# Altium schematic sheet Comm.SchDoc
size A3
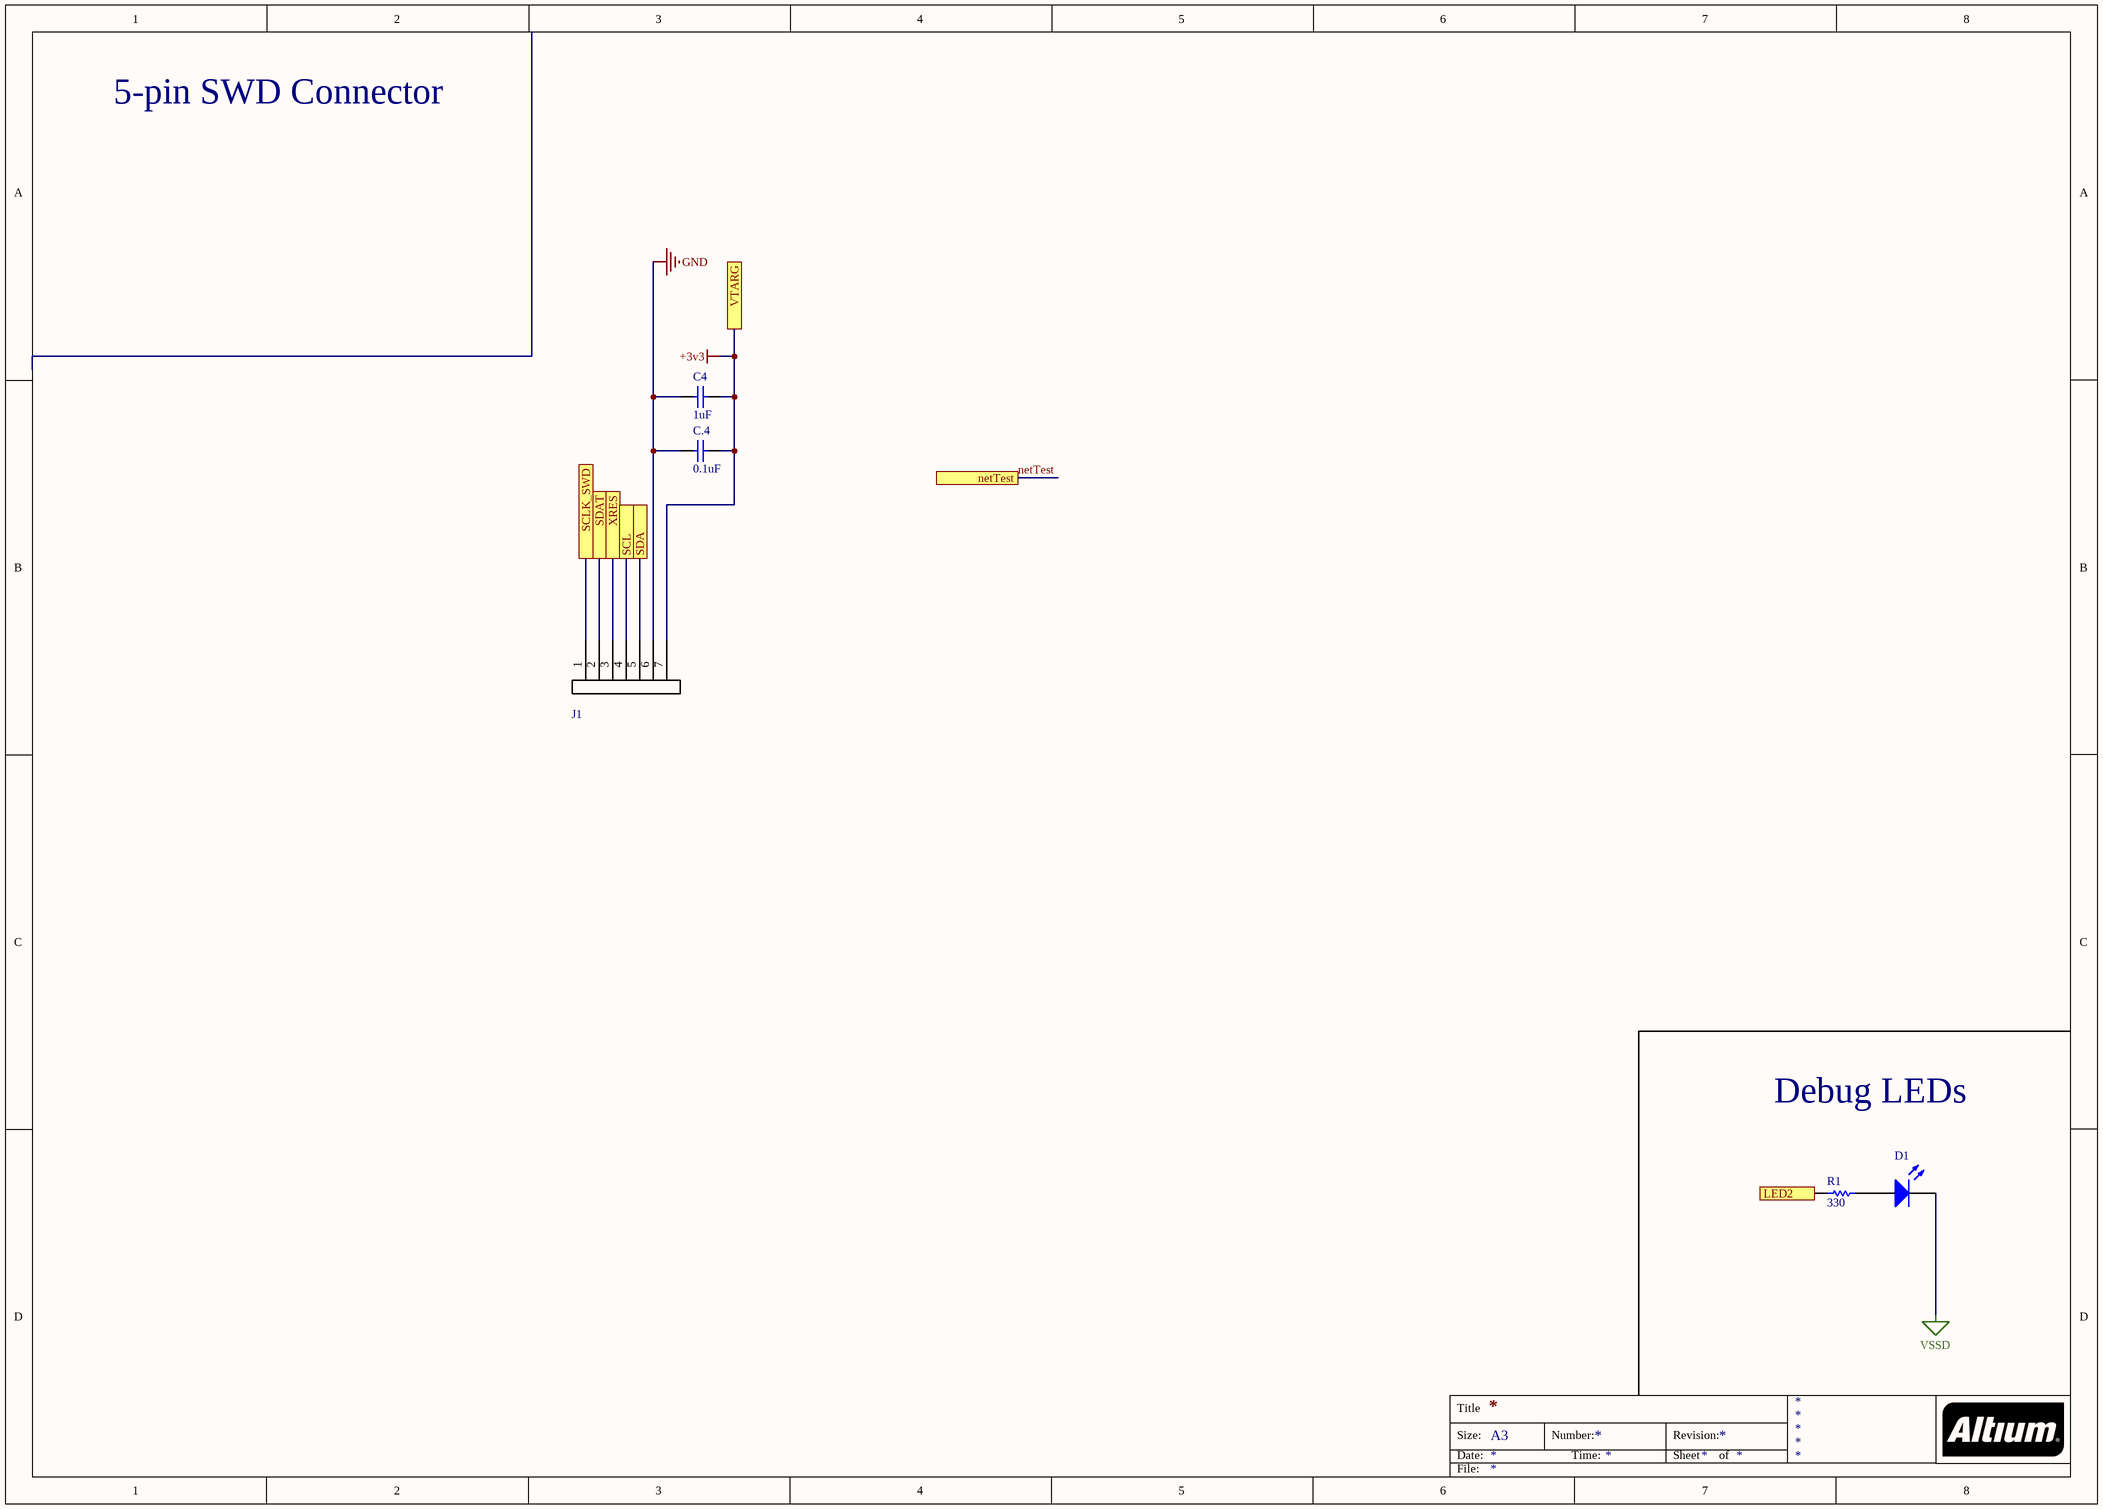
[diagram p0: Comm.SchDoc]

## Parts
C4  1uF  [CAPC0603(1608)100_N]
C.4  0.1uF  [CAPC0603(1608)100_N]
D1  150060BS75000  [0603_A]  (value not drawn)
J1  BM07B-NSHSS-TBT (LF)(SN)  [BM07B-NSHSS-TBT (LF)(SN)]  (value not drawn)
R1  330  [RESC0603(1608)_L]

## Ports
LED2 (in), netTest, SCL, SCLK_SWD, SDA, SDAT, VTARG, XRES

## Nets
+3v3: C4.1 C.4.1 J1.7 ; port VTARG
GND: C4.2 C.4.2 J1.6
VSSD: D1.1(K)
LED2: R1.1 ; port LED2
netTest: port netTest
SCL: J1.4 ; port SCL
SCLK_SWD: J1.1 ; port SCLK_SWD
SDA: J1.5 ; port SDA
SDAT: J1.2 ; port SDAT
XRES: J1.3 ; port XRES
NetD1_2: D1.2(A) R1.2

## Notes on the sheet
- 5-pin SWD Connector
- Debug LEDs
- Title
- Size:
- Date:
- A3
- Number:
- Time:
- Revision:
- Sheet
- of
- File:

## Library data of the parts
C4 = CMP-1035-02746-1: CAP 1uF 50V ±20% 0603 (1608 Metric) Thickness 1mm SMD; Tolerance: Â±20%; Case-EIA: 0603; Case-Metric: 1608; Value: 1uF; Technology: SMT; Max Thickness: 1 mm; Rated Voltage: 50 V
C.4 = CMP-1035-02746-1: CAP 0.1 uF 50V ±20% 0603 (1608 Metric) Thickness 1mm SMD; Tolerance: Â±20%; Value: 1uF; Case-EIA: 0603; Case-Metric: 1608; Technology: SMT; Max Thickness: 1 mm; Rated Voltage: 50 V
D1 = CMP-1426-00003-1: SMD mono-color Chip LED, WL-SMCW, Blue; Manufacturer: Wuerth Elektronik; Color: Blue; ComponentLink2Description: Datasheet; ComponentLink2URL: http://katalog.we-online.com/led/datasheet/150060BS75000.pdf; ComponentLink1URL: http://www.we-online.com; PackageReference: 0603_A; PartNumber: 150060BS75000; ComponentLink1Description: Manufacturer URL
R1 = CMP-1012-00062-1: 330R 0.1W 5% 0603 (1608 Metric)  SMD; Value: 330.00 Ohm; Case-EIA: 0603; Case-Metric: 1608; Tolerance: 5 %; Power: 0.1 W; Technology: SMT